# Altium schematic sheet 09C_KB_LED_AND_LED.SchDoc
size 420 x 297 mm
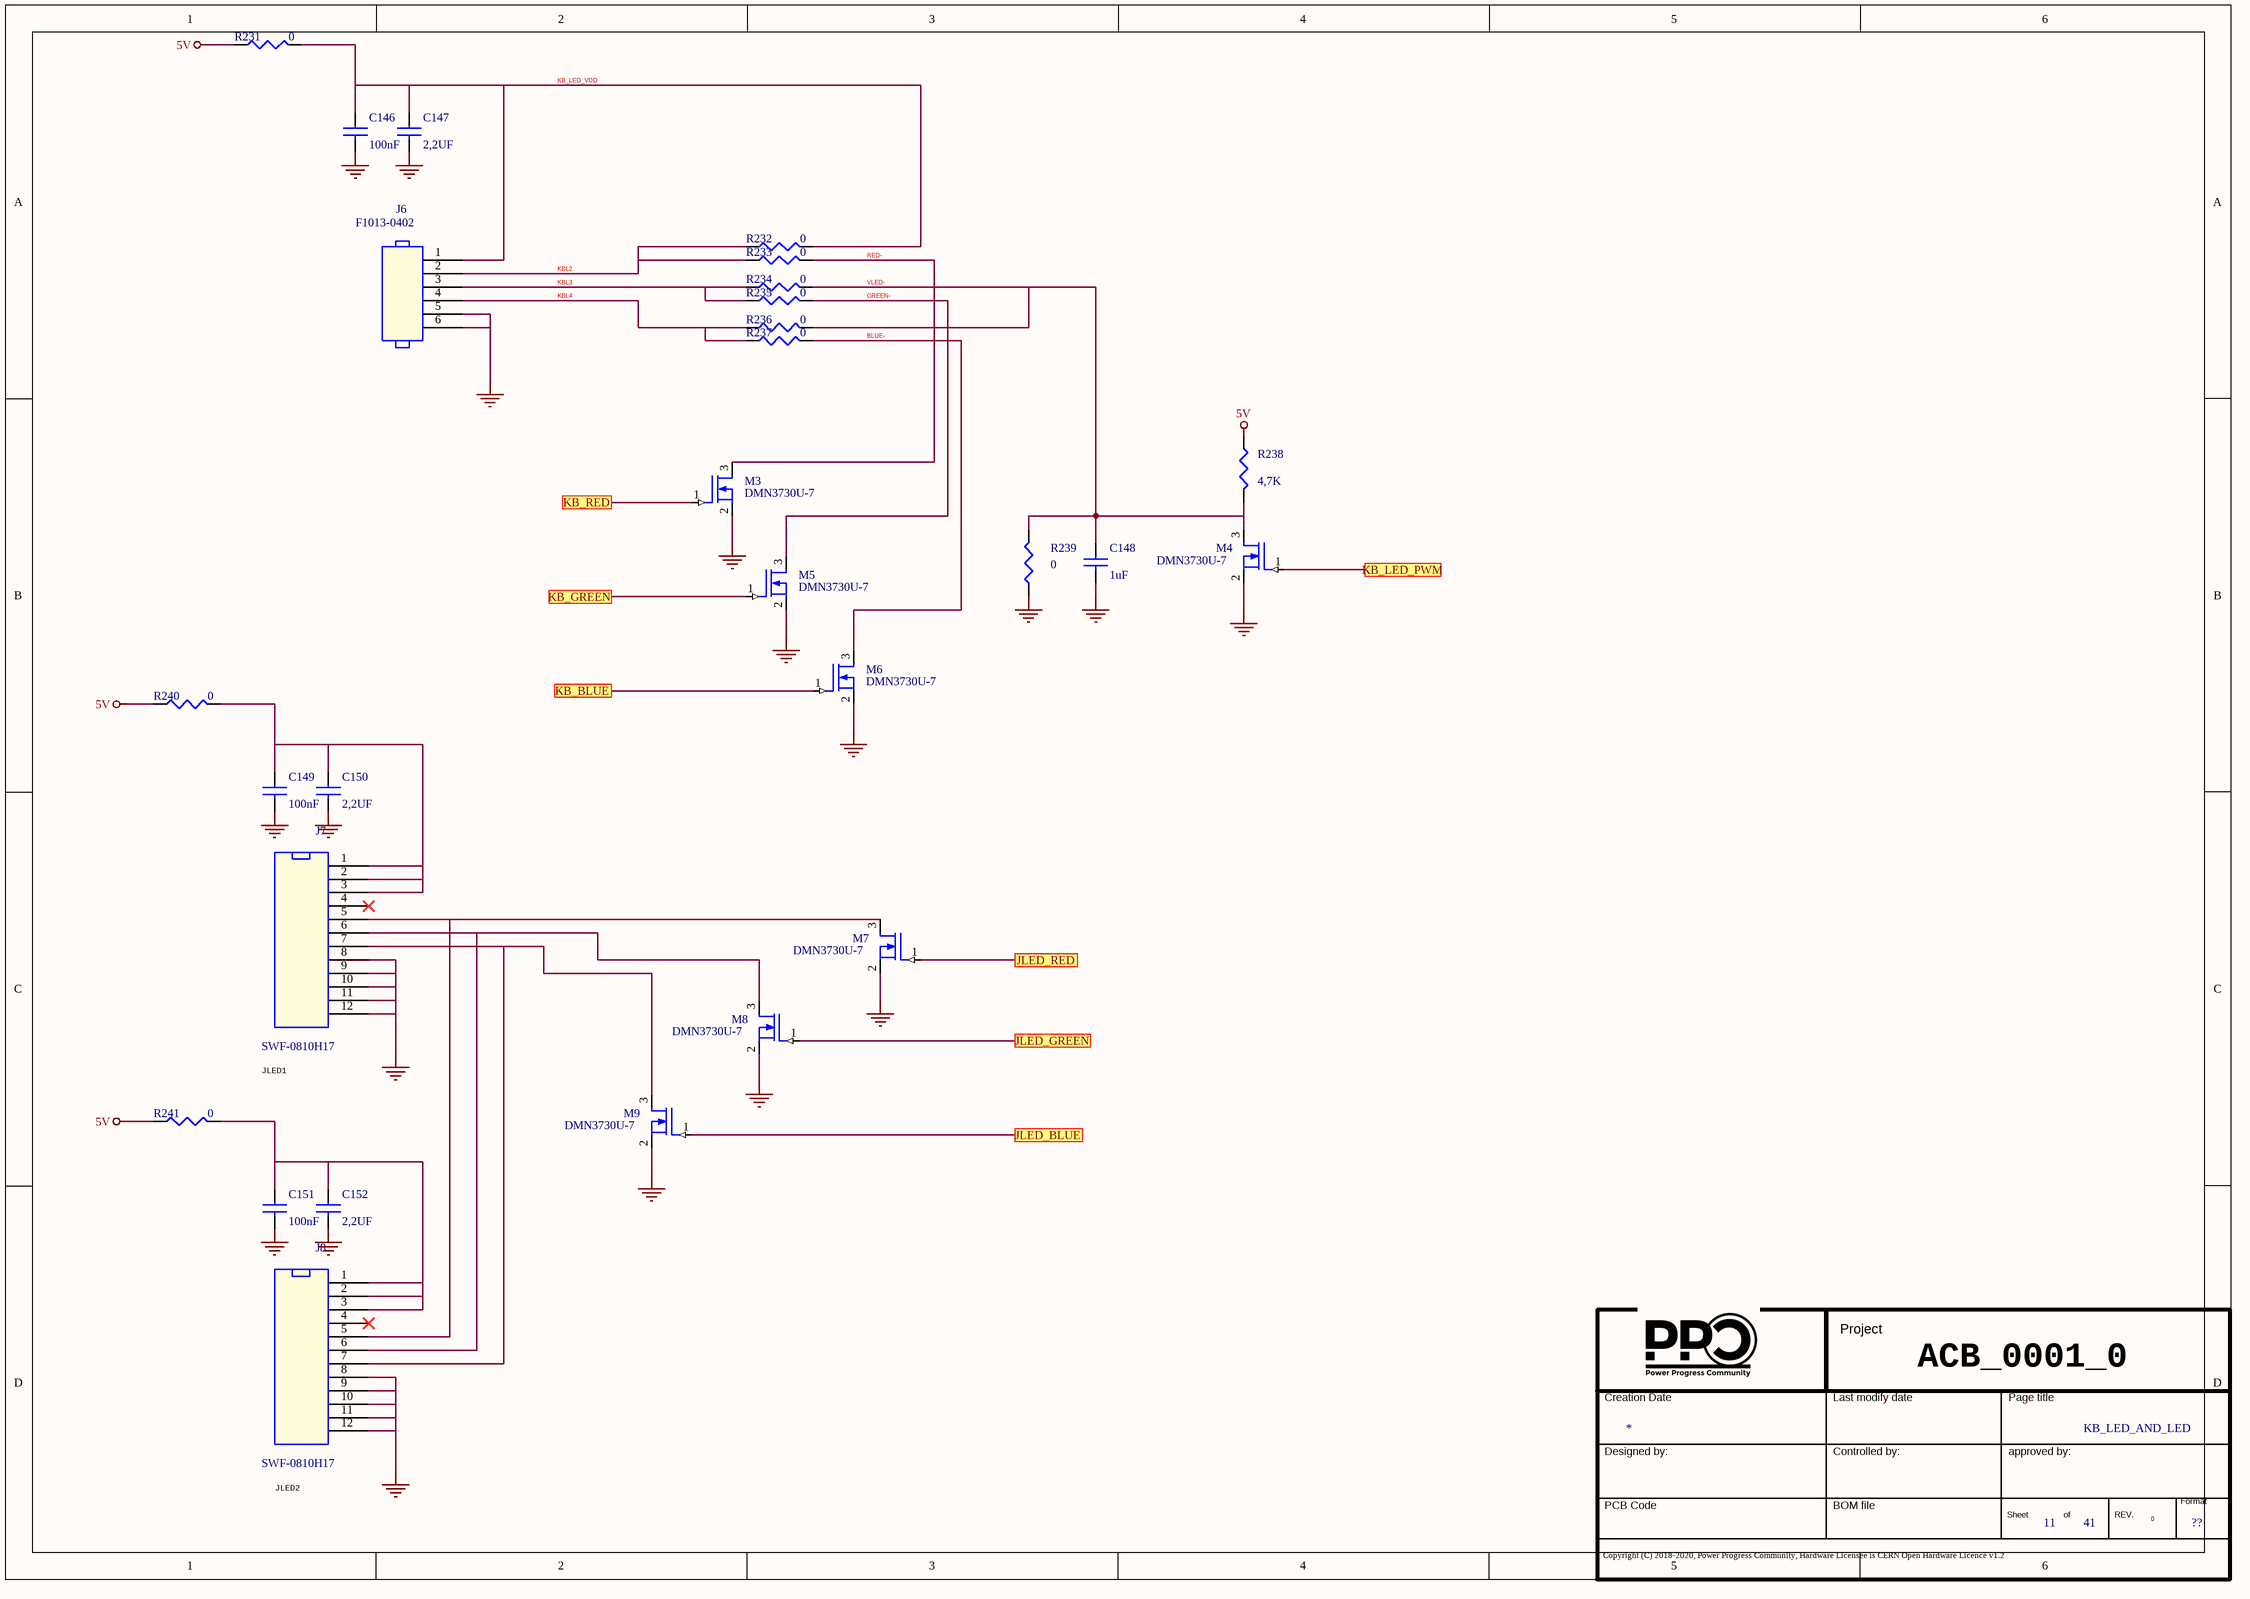
[diagram p0: 09C_KB_LED_AND_LED.SchDoc]

## Parts
*  Doc: KB_LED_AND_LED  Page Count: 41  Page Number: 11  Page Size: ??  RevCode: 0  (hidden comment: Title_block_PPC)  (graphical)
C146  100nF  [SMD_0402]
C147  2,2UF  [SMD_0402]
C148  1uF  [SMD_0402]
C149  100nF  [SMD_0402]
C150  2,2UF  [SMD_0402]
C151  100nF  [SMD_0402]
C152  2,2UF  [SMD_0402]
J6  F1013-0402  [PTH]
J7  SWF-0810H17  [SMD_2X50_P=0.635mm]
J8  SWF-0810H17  [SMD_2X50_P=0.635mm]
M3  DMN3730U-7  [sot23]
M4  DMN3730U-7  [sot23]
M5  DMN3730U-7  [sot23]
M6  DMN3730U-7  [sot23]
M7  DMN3730U-7  [sot23]
M8  DMN3730U-7  [sot23]
M9  DMN3730U-7  [sot23]
R231  0  [SMD_0402]
R232  0  [SMD_0402]
R233  0  [SMD_0402]
R234  0  [SMD_0402]
R235  0  [SMD_0402]
R236  0  [SMD_0402]
R237  0  [SMD_0402]
R238  4,7K  [SMD_0402]
R239  0  [SMD_0402]
R240  0  [SMD_0402]
R241  0  [SMD_0402]

## Ports
JLED_BLUE, JLED_GREEN, JLED_RED, KB_BLUE, KB_GREEN, KB_LED_PWM, KB_RED

## Nets
5V: R231.1 R238.1 R240.1 R241.1
GND: C146.2 C147.2 C148.2 C149.2 C150.2 C151.2 C152.2 J6.5 J6.6 J7.8 J7.9 J7.10 J7.11 J7.12 J8.8 J8.9 J8.10 J8.11 J8.12 M3.2(SOURCE) M4.2(SOURCE) M5.2(SOURCE) M6.2(SOURCE) M7.2(SOURCE) M8.2(SOURCE) M9.2(SOURCE) R239.1
BLUE-: M6.3(DRAIN) R237.2
GREEN-: M5.3(DRAIN) R235.2
JLED_BLUE: M9.1(GATE) ; port JLED_BLUE
JLED_GREEN: M8.1(GATE) ; port JLED_GREEN
JLED_RED: M7.1(GATE) ; port JLED_RED
KB_BLUE: M6.1(GATE) ; port KB_BLUE
KB_GREEN: M5.1(GATE) ; port KB_GREEN
KB_LED_PWM: M4.1(GATE) ; port KB_LED_PWM
KB_LED_VDD: C146.1 C147.1 J6.1 R231.2 R232.2
KB_RED: M3.1(GATE) ; port KB_RED
KBL2: J6.2 R232.1 R233.1
KBL3: J6.3 R234.1 R235.1
KBL4: J6.4 R236.1 R237.1
RED-: M3.3(DRAIN) R233.2
VLED-: C148.1 M4.3(DRAIN) R234.2 R236.2 R238.2 R239.2
NetC149_1: C149.1 C150.1 J7.1 J7.2 J7.3 R240.2
NetC151_1: C151.1 C152.1 J8.1 J8.2 J8.3 R241.2
NetJ7_5: J7.5 J8.5 M7.3(DRAIN)
NetJ7_6: J7.6 J8.6 M8.3(DRAIN)
NetJ7_7: J7.7 J8.7 M9.3(DRAIN)

Not connected (* = marked no-connect by the designer): J7 4*; J8 4*

## Notes on the sheet
- JLED1
- ACB_0001_0
- JLED2
- (in symbol Title_block_PPC) Project; Creation Date; Last modify date; Page title; Designed by:; Controlled by:; approved by:; Format; PCB Code; BOM file; Sheet; of; REV.; Copyright (C) 2018-2020, Power Progress Community, Hardware Licensee is CERN Open Hardware Licence v1.2

## Library data of the parts
* = Title_block_PPC: Title: T2080PCIe; Schematic Page Count: 45; Schematic Page Number: 13; Author: MICETEK; Page Create Date: March  8, 1995; Page Title: ?; Page Modify Date: *
C146 = CAP NP_Dup9: COND.CER. 100NF 50V 0402 X7R SMD; Part Number: PASSIVE_24; Manufacturer 1: TDK; Manufacturer Part Number 1: CGA2B3X7R1H104M050BD; RSM: RC0402; PCB Footprint: SMD_0402; Part Type: Capacitors\Ceramic\SMD\0402; Distributor 1: MODULI ELETTRONICI E COMPONENTI spa
C147 = CAP NP_Dup9: CAP CERAMIC 2.2UF 6.3V X5R 0402; Part Number: PASSIVE_55; Manufacturer 1: Panasonic - ECG; Manufacturer Part Number 1: ECJ-0EB0J225M; RSM: RC0402; PCB Footprint: SMD_0402; Part Type: Capacitors\Ceramic\SMD\0402; Distributor 1: DIGIKEY (PCC2421TR-ND)
C148 = CAP NP_Dup2: CAP CER 1UF 6.3V 10% X5R 0402 AUTOMOTIVE; Part Number: PASSIVE_49; Manufacturer 1: Taiyo Yuden; Manufacturer Part Number 1: JMK105BJ105KVHF; RSM: RC0402; PCB Footprint: SMD_0402; Part Type: Capacitors\Ceramic\SMD\0402; Distributor 1: DIGIKEY (587-3766-1-ND)
C149 C151 = CAP NP_Dup9: COND.CER. 100NF 50V 0402 X7R SMD; Manufacturer Part Number 1: CGA2B3X7R1H104M050BD; Manufacturer 1: TDK; Part Number: PASSIVE_24; RSM: RC0402; PCB Footprint: SMD_0402; Distributor 1: MODULI ELETTRONICI E COMPONENTI spa; Part Type: Capacitors\Ceramic\SMD\0402
C150 C152 = CAP NP_Dup9: CAP CERAMIC 2.2UF 6.3V X5R 0402; Manufacturer Part Number 1: ECJ-0EB0J225M; Manufacturer 1: Panasonic - ECG; Part Number: PASSIVE_55; RSM: RC0402; PCB Footprint: SMD_0402; Distributor 1: DIGIKEY (PCC2421TR-ND); Part Type: Capacitors\Ceramic\SMD\0402
J6 = HEADER_6: STRIP MASC.1x6P CS.p=2.54mm; Part Number: CONNECTORS_462; Manufacturer 1: Samtec; Manufacturer Part Number 1: TSW-106-24-T-S; RSM: PIN-100MLS-6; PCB Footprint: PTH; Part Type: Strip\Terminal; Distributor 1: CLAITRON LASI SILVESTAR S.R.L.
J7 J8 = HEADER_12X1_Dup1: STRIP MASCH.1x12P CS.p=2.0mm SMT; PART NUMBER: CONNECTORS_498; Manufacturer 1: Samtec; Manufacturer Part Number 1: TMM-112-01-G-S; PCB Footprint: 12X1P=2.0mm SMT; RSM: PIN6-12-SMD; Part Type: Strip\Terminal; Distributor 1: FARNELL(1668553)
M3-M5 M8 M9 = NMOS_SOT23: DMN3730U-7 N 750mA 30V POWER MOS; Part Number: DISCRETE_305; Manufacturer 1: DIOES; RSM: SOT-23; PCB Footprint: sot23; Part Type: Mosfet\SOT23; Manufacturer Part Number 1: DMN3730U-7; Distributor 1: DIGIKEY(DMN3730U-7DICT-ND)
M6 M7 = NMOS_SOT23: DMN3730U-7 N 750mA 30V POWER MOS; Manufacturer 1: DIOES; Part Number: DISCRETE_305; RSM: SOT-23; PCB Footprint: sot23; Distributor 1: DIGIKEY(DMN3730U-7DICT-ND); Manufacturer Part Number 1: DMN3730U-7; Part Type: Mosfet\SOT23
R231 R239 = R_Dup8: RESIS.CHIP 0R 5% 0402 SMD; Manufacturer 1: ROYAL OHM; Part Number: PASSIVE_805; RSM: RC0402; PCB Footprint: SMD_0402; Distributor 1: CAMEL ELETTRONICA SRL  #; Manufacturer Part Number 1: RESIS.CHIP 0R 5% 0402 SMD; Part Type: Resistors\Fixed\SMD\0402\5%
R232-R237 R240 R241 = R_Dup8: RESIS.CHIP 0R 5% 0402 SMD; Part Number: PASSIVE_805; Manufacturer 1: ROYAL OHM; RSM: RC0402; PCB Footprint: SMD_0402; Part Type: Resistors\Fixed\SMD\0402\5%; Manufacturer Part Number 1: RESIS.CHIP 0R 5% 0402 SMD; Distributor 1: CAMEL ELETTRONICA SRL  #
R238 = R_Dup5: RESIS.CHIP 4,7K 5% 0402 SMD; Manufacturer 1: ROYAL OHM; Part Number: PASSIVE_861; RSM: RC0402; PCB Footprint: SMD_0402; Distributor 1: CAMEL ELETTRONICA SRL  #; Manufacturer Part Number 1: RESIS.CHIP 4,7K 5% 0402 SMD; Part Type: Resistors\Fixed\SMD\0402\5%